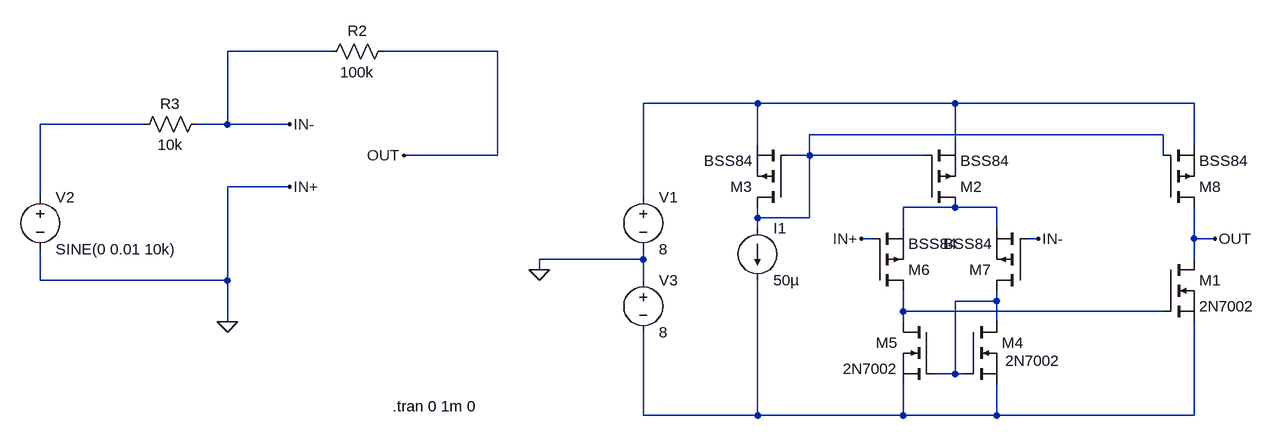
[diagram p0: schematic OPERACIONAL.asc]
OPERACIONAL.asc, the LTspice schematic file:
Version 4
SHEET 1 1040 680
WIRE -624 -112 -784 -112
WIRE -368 -112 -544 -112
WIRE 32 -32 -144 -32
WIRE 336 -32 32 -32
WIRE 704 -32 336 -32
WIRE -912 0 -1072 0
WIRE -784 0 -784 -112
WIRE -784 0 -832 0
WIRE -688 0 -784 0
WIRE 656 16 112 16
WIRE 32 32 32 -32
WIRE 336 32 336 -32
WIRE 704 32 704 -32
WIRE -368 48 -368 -112
WIRE -368 48 -512 48
WIRE 112 48 112 16
WIRE 112 48 80 48
WIRE 288 48 112 48
WIRE 656 48 656 16
WIRE -688 96 -784 96
WIRE -1072 112 -1072 0
WIRE -144 112 -144 -32
WIRE 336 128 256 128
WIRE 400 128 336 128
WIRE 32 144 32 128
WIRE 112 144 112 48
WIRE 112 144 32 144
WIRE 32 160 32 144
WIRE 256 160 256 128
WIRE 400 160 400 128
WIRE 208 176 192 176
WIRE 464 176 448 176
WIRE 704 176 704 128
WIRE 736 176 704 176
WIRE -144 208 -144 192
WIRE -144 208 -304 208
WIRE 704 208 704 176
WIRE -304 224 -304 208
WIRE -1072 240 -1072 192
WIRE -784 240 -784 96
WIRE -784 240 -1072 240
WIRE -144 240 -144 208
WIRE 400 272 400 256
WIRE 400 272 336 272
WIRE 256 288 256 256
WIRE 656 288 256 288
WIRE -784 304 -784 240
WIRE 256 304 256 288
WIRE 400 304 400 272
WIRE 336 384 336 272
WIRE 336 384 304 384
WIRE 352 384 336 384
WIRE -144 448 -144 320
WIRE 32 448 32 240
WIRE 32 448 -144 448
WIRE 256 448 256 400
WIRE 256 448 32 448
WIRE 400 448 400 400
WIRE 400 448 256 448
WIRE 704 448 704 304
WIRE 704 448 400 448
FLAG -304 224 0
FLAG 464 176 IN-
FLAG 192 176 IN+
FLAG 736 176 OUT
FLAG -688 96 IN+
FLAG -688 0 IN-
FLAG -512 48 OUT
FLAG -784 304 0
SYMBOL nmos 656 208 R0
SYMATTR InstName M1
SYMATTR Value 2N7002
SYMBOL pmos 288 128 M180
SYMATTR InstName M2
SYMATTR Value BSS84
SYMBOL pmos 80 128 R180
SYMATTR InstName M3
SYMATTR Value BSS84
SYMBOL voltage -144 96 R0
WINDOW 123 0 0 Left 0
WINDOW 39 0 0 Left 0
SYMATTR InstName V1
SYMATTR Value 8
SYMBOL current 32 160 R0
WINDOW 123 0 0 Left 0
WINDOW 39 0 0 Left 0
SYMATTR InstName I1
SYMATTR Value 50µ
SYMBOL voltage -1072 96 R0
WINDOW 123 0 0 Left 0
WINDOW 39 0 0 Left 0
SYMATTR InstName V2
SYMATTR Value SINE(0 0.01 10k)
SYMBOL nmos 352 304 R0
WINDOW 3 61 60 Left 2
SYMATTR InstName M4
SYMATTR Value 2N7002
SYMBOL nmos 304 304 M0
SYMATTR InstName M5
SYMATTR Value 2N7002
SYMBOL pmos 208 256 M180
SYMATTR InstName M6
SYMATTR Value BSS84
SYMBOL pmos 448 256 R180
SYMATTR InstName M7
SYMATTR Value BSS84
SYMBOL pmos 656 128 M180
SYMATTR InstName M8
SYMATTR Value BSS84
SYMBOL voltage -144 224 R0
WINDOW 123 0 0 Left 0
WINDOW 39 0 0 Left 0
SYMATTR InstName V3
SYMATTR Value 8
SYMBOL res -528 -128 R90
WINDOW 0 0 56 VBottom 2
WINDOW 3 32 56 VTop 2
SYMATTR InstName R2
SYMATTR Value 100k
SYMBOL res -816 -16 R90
WINDOW 0 0 56 VBottom 2
WINDOW 3 32 56 VTop 2
SYMATTR InstName R3
SYMATTR Value 10k
TEXT -530 434 Left 2 !.tran 0 1m 0

The netlist it stands for:
* OPERACIONAL.asc
M1 OUT N006 N007 N007 2N7002
M2 N004 N003 N001 N001 BSS84
M3 N003 N003 N001 N001 BSS84
V1 N001 0 8
I1 N003 N007 50µ
V2 N002 0 SINE(0 0.01 10k)
M4 N005 N005 N007 N007 2N7002
M5 N006 N005 N007 N007 2N7002
M6 N006 0 N004 N004 BSS84
M7 N005 IN- N004 N004 BSS84
M8 OUT N003 N001 N001 BSS84
V3 0 N007 8
R2 OUT IN- 100k
R3 IN- N002 10k
.model NMOS NMOS
.model PMOS PMOS
.lib standard.mos
.tran 0 1m 0
.backanno
.end